# EAGLE design schematic (EAGLE 7.2.0)
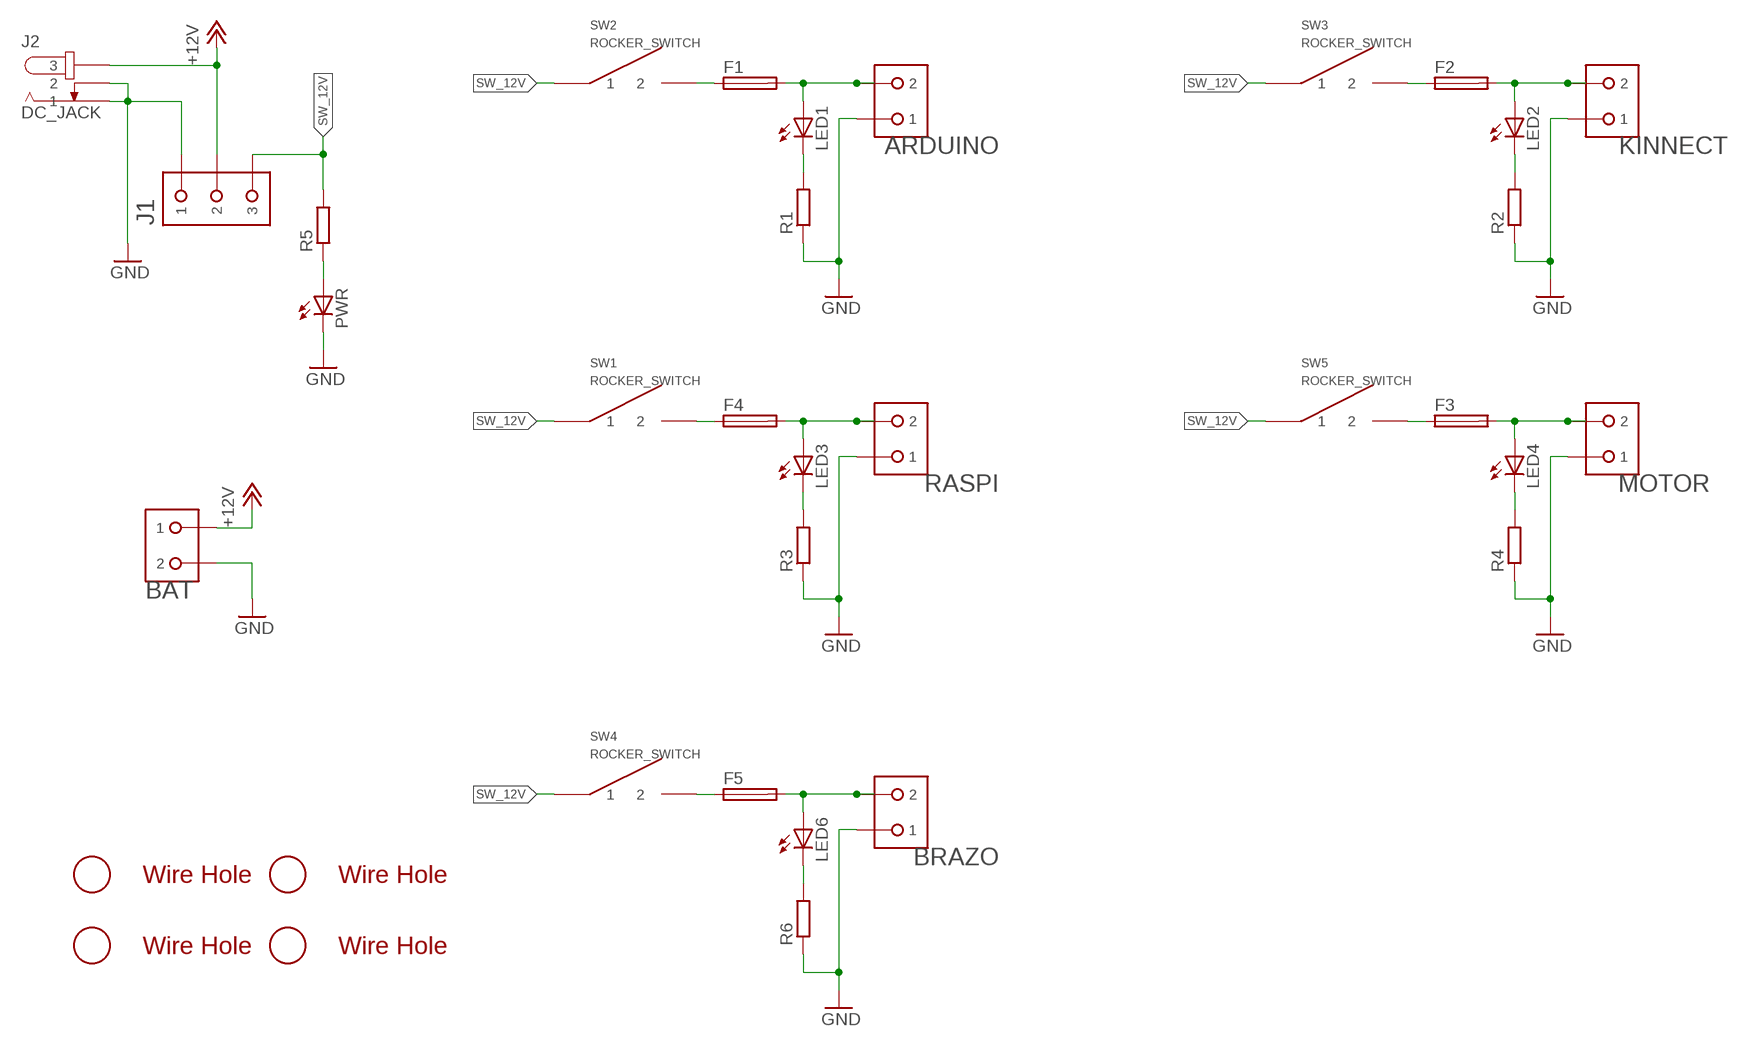
[diagram p0: schematic, sheet 1]

## Parts
ARDUINO  B2P-VH(LF)(SN)  [B2P]
BAT  B2P-VH(LF)(SN)  [B2P]
BRAZO  B2P-VH(LF)(SN)  [B2P]
F1  FUSETE5  [TE5]
F2  FUSETE5  [TE5]
F3  FUSETE5  [TE5]
F4  FUSETE5  [TE5]
F5  FUSETE5  [TE5]
J1  B3P-VH  [B3P-VH]
J2  DC_JACK  [DC_JACK]
KINNECT  B2P-VH(LF)(SN)  [B2P]
LED1  LEDCHIP-LED0805  [CHIP-LED0805]
LED2  LEDCHIP-LED0805  [CHIP-LED0805]
LED3  LEDCHIP-LED0805  [CHIP-LED0805]
LED4  LEDCHIP-LED0805  [CHIP-LED0805]
LED6  LEDCHIP-LED0805  [CHIP-LED0805]
MOTOR  B2P-VH(LF)(SN)  [B2P]
PWR  LED3MM  [LED3MM]
R1  R-EU_R0805  [R0805]
R2  R-EU_R0805  [R0805]
R3  R-EU_R0805  [R0805]
R4  R-EU_R0805  [R0805]
R5  R-EU_R0805  [R0805]
R6  R-EU_R0805  [R0805]
RASPI  B2P-VH(LF)(SN)  [B2P]
SW1  ROCKER_SWITCH  [ROCKER_SWITCH]
SW2  ROCKER_SWITCH  [ROCKER_SWITCH]
SW3  ROCKER_SWITCH  [ROCKER_SWITCH]
SW4  ROCKER_SWITCH  [ROCKER_SWITCH]
SW5  ROCKER_SWITCH  [ROCKER_SWITCH]
U$1  3MMHOLE  [3MMHOLE]
U$3  3MMHOLE  [3MMHOLE]
U$4  3MMHOLE  [3MMHOLE]
U$5  3MMHOLE  [3MMHOLE]

## Nets
+12V: BAT.1 J1.2 J2.2 J2.8 J2.9
GND: ARDUINO.1 BAT.2 BRAZO.1 J1.1 J2.1 J2.3 J2.4 J2.5 J2.6 J2.7 KINNECT.1 MOTOR.1 PWR.K(C) R1.1 R2.1 R3.1 R4.1 R6.1 RASPI.1
N$1: ARDUINO.2 F1.2 LED1.A
N$2: LED1.C R1.2
N$3: F2.2 KINNECT.2 LED2.A
N$5: F4.2 LED3.A RASPI.2
N$6: LED2.C R2.2
N$7: F3.2 LED4.A MOTOR.2
N$9: F1.1 SW2.P$12 SW2.P$13 SW2.P$14 SW2.P$15 SW2.P$16 SW2.P$17 SW2.P$18 SW2.P$19 SW2.P$20 SW2.P$21 SW2.P$22
N$10: F4.1 SW1.P$12 SW1.P$13 SW1.P$14 SW1.P$15 SW1.P$16 SW1.P$17 SW1.P$18 SW1.P$19 SW1.P$20 SW1.P$21 SW1.P$22
N$11: F3.1 SW5.P$12 SW5.P$13 SW5.P$14 SW5.P$15 SW5.P$16 SW5.P$17 SW5.P$18 SW5.P$19 SW5.P$20 SW5.P$21 SW5.P$22
N$12: F2.1 SW3.P$12 SW3.P$13 SW3.P$14 SW3.P$15 SW3.P$16 SW3.P$17 SW3.P$18 SW3.P$19 SW3.P$20 SW3.P$21 SW3.P$22
N$13: LED4.C R4.2
N$14: PWR.A R5.1
N$15: BRAZO.2 F5.2 LED6.A
N$17: F5.1 SW4.P$12 SW4.P$13 SW4.P$14 SW4.P$15 SW4.P$16 SW4.P$17 SW4.P$18 SW4.P$19 SW4.P$20 SW4.P$21 SW4.P$22
N$18: LED3.C R3.2
N$20: LED6.C R6.2
SW_12V: J1.3 R5.2 SW1.P$1 SW1.P$2 SW1.P$3 SW1.P$4 SW1.P$5 SW1.P$6 SW1.P$7 SW1.P$8 SW1.P$9 SW1.P$10 SW1.P$11 SW2.P$1 SW2.P$2 SW2.P$3 SW2.P$4 SW2.P$5 SW2.P$6 SW2.P$7 SW2.P$8 SW2.P$9 SW2.P$10 SW2.P$11 SW3.P$1 SW3.P$2 SW3.P$3 SW3.P$4 SW3.P$5 SW3.P$6 SW3.P$7 SW3.P$8 SW3.P$9 SW3.P$10 SW3.P$11 SW4.P$1 SW4.P$2 SW4.P$3 SW4.P$4 SW4.P$5 SW4.P$6 SW4.P$7 SW4.P$8 SW4.P$9 SW4.P$10 SW4.P$11 SW5.P$1 SW5.P$2 SW5.P$3 SW5.P$4 SW5.P$5 SW5.P$6 SW5.P$7 SW5.P$8 SW5.P$9 SW5.P$10 SW5.P$11

## Library data of the parts
ARDUINO BAT BRAZO KINNECT MOTOR RASPI = RoboJackets-Connectors:B2P?-VH(LF)(SN): Power Connector Brand: JST Sales America Inc. <https://www.jst.com/> Series: VH <http://www.digikey.com/product-search/en?FV=fff40016,fff802f3,ffec0e9d> Distributor: Digi-Key <http://www.digikey.com/product-detail/en/B2PS-VH%28LF%29%28SN%29/455-1648-ND/926555>; PINS: 2; PIN_PITCH: 3.96 mm
F1-F5 = fuse:FUSE: Fuse; OC_FARNELL: unknown; OC_NEWARK: unknown
J1 = 0user:B3P-VH
J2 = 0user:DC_JACK
LED1-LED4 LED6 = RepRapjr:LED: LED OSRAM: - CHIPLED LG R971, LG N971, LY N971, LG Q971, LY Q971, LO R971, LY R971 LH N974, LH R974 LS Q976, LO Q976, LY Q976 LO Q996 - Hyper CHIPLED LW Q18S LB Q993, LB Q99A, LB R99A - SideLED LS A670, LO A670, LY A670, LG A670, LP A670 LB A673, LV A673, LT A673, LW A673 LH A674 LY A675 LS A676, LA A676, LO A676, LY A676, LW A676 LS A679, LY A679, LG A679 - Hyper Micro SIDELED® LS Y876, LA Y876, LO Y876, LY Y876 LT Y87S - SmartLED LW L88C, LW L88S LB L89C, LB L89S, LG L890 LS L89K, LO L89K, LY L89K LS L896, LA L896, LO L896, LY L896 - TOPLED LS T670, LO T670, LY T670, LG T670, LP T670 LSG T670, LSP T670, LSY T670, LOP T670, LYG T670 LG T671, LOG T671, LSG T671 LB T673, LV T673, LT T673, LW T673 LH T674 LS T676, LA T676, LO T676, LY T676, LB T676, LH T676, LSB T676, LW T676 LB T67C, LV T67C, LT T67C, LS T67K, LO T67K, LY T67K, LW E67C LS E67B, LA E67B, LO E67B, LY E67B, LB E67C, LV E67C, LT E67C LW T67C LS T679, LY T679, LG T679 LS T770, LO T770, LY T770, LG T770, LP T770 LB T773, LV T773, LT T773, LW T773 LH T774 LS E675, LA E675, LY E675, LS T675 LS T776, LA T776, LO T776, LY T776, LB T776 LHGB T686 LT T68C, LB T68C - Hyper Mini TOPLED® LB M676 - Mini TOPLED Santana® LG M470 LS M47K, LO M47K, LY M47K Source: http://www.osram.convergy.de LUXEON: - LUMILED® LXK2-PW12-R00, LXK2-PW12-S00, LXK2-PW14-U00, LXK2-PW14-V00 LXK2-PM12-R00, LXK2-PM12-S00, LXK2-PM14-U00 LXK2-PE12-Q00, LXK2-PE12-R00, LXK2-PE12-S00, LXK2-PE14-T00, LXK2-PE14-U00 LXK2-PB12-K00, LXK2-PB12-L00, LXK2-PB12-M00, LXK2-PB14-N00, LXK2-PB14-P00, LXK2-PB14-Q00 LXK2-PR12-L00, LXK2-PR12-M00, LXK2-PR14-Q00, LXK2-PR14-R00 LXK2-PD12-Q00, LXK2-PD12-R00, LXK2-PD12-S00 LXK2-PH12-R00, LXK2-PH12-S00 LXK2-PL12-P00, LXK2-PL12-Q00, LXK2-PL12-R00 Source: www.luxeon.com KINGBRIGHT: KA-3528ASYC Source: www.kingbright.com
PWR = led:LED: LED OSRAM: - CHIPLED LG R971, LG N971, LY N971, LG Q971, LY Q971, LO R971, LY R971 LH N974, LH R974 LS Q976, LO Q976, LY Q976 LO Q996 - Hyper CHIPLED LW Q18S LB Q993, LB Q99A, LB R99A - SideLED LS A670, LO A670, LY A670, LG A670, LP A670 LB A673, LV A673, LT A673, LW A673 LH A674 LY A675 LS A676, LA A676, LO A676, LY A676, LW A676 LS A679, LY A679, LG A679 - Hyper Micro SIDELED® LS Y876, LA Y876, LO Y876, LY Y876 LT Y87S - SmartLED LW L88C, LW L88S LB L89C, LB L89S, LG L890 LS L89K, LO L89K, LY L89K LS L896, LA L896, LO L896, LY L896 - TOPLED LS T670, LO T670, LY T670, LG T670, LP T670 LSG T670, LSP T670, LSY T670, LOP T670, LYG T670 LG T671, LOG T671, LSG T671 LB T673, LV T673, LT T673, LW T673 LH T674 LS T676, LA T676, LO T676, LY T676, LB T676, LH T676, LSB T676, LW T676 LB T67C, LV T67C, LT T67C, LS T67K, LO T67K, LY T67K, LW E67C LS E67B, LA E67B, LO E67B, LY E67B, LB E67C, LV E67C, LT E67C LW T67C LS T679, LY T679, LG T679 LS T770, LO T770, LY T770, LG T770, LP T770 LB T773, LV T773, LT T773, LW T773 LH T774 LS E675, LA E675, LY E675, LS T675 LS T776, LA T776, LO T776, LY T776, LB T776 LHGB T686 LT T68C, LB T68C - Hyper Mini TOPLED® LB M676 - Mini TOPLED Santana® LG M470 LS M47K, LO M47K, LY M47K Source: http://www.osram.convergy.de LUXEON: - LUMILED® LXK2-PW12-R00, LXK2-PW12-S00, LXK2-PW14-U00, LXK2-PW14-V00 LXK2-PM12-R00, LXK2-PM12-S00, LXK2-PM14-U00 LXK2-PE12-Q00, LXK2-PE12-R00, LXK2-PE12-S00, LXK2-PE14-T00, LXK2-PE14-U00 LXK2-PB12-K00, LXK2-PB12-L00, LXK2-PB12-M00, LXK2-PB14-N00, LXK2-PB14-P00, LXK2-PB14-Q00 LXK2-PR12-L00, LXK2-PR12-M00, LXK2-PR14-Q00, LXK2-PR14-R00 LXK2-PD12-Q00, LXK2-PD12-R00, LXK2-PD12-S00 LXK2-PH12-R00, LXK2-PH12-S00 LXK2-PL12-P00, LXK2-PL12-Q00, LXK2-PL12-R00 Source: www.luxeon.com KINGBRIGHT: KA-3528ASYC Source: www.kingbright.com
R1-R6 = rcl:R-EU_: RESISTOR, European symbol
SW1-SW5 = 0user:ROCKER_SWITCH
U$1 U$3-U$5 = reprap:3MMHOLE

## Board
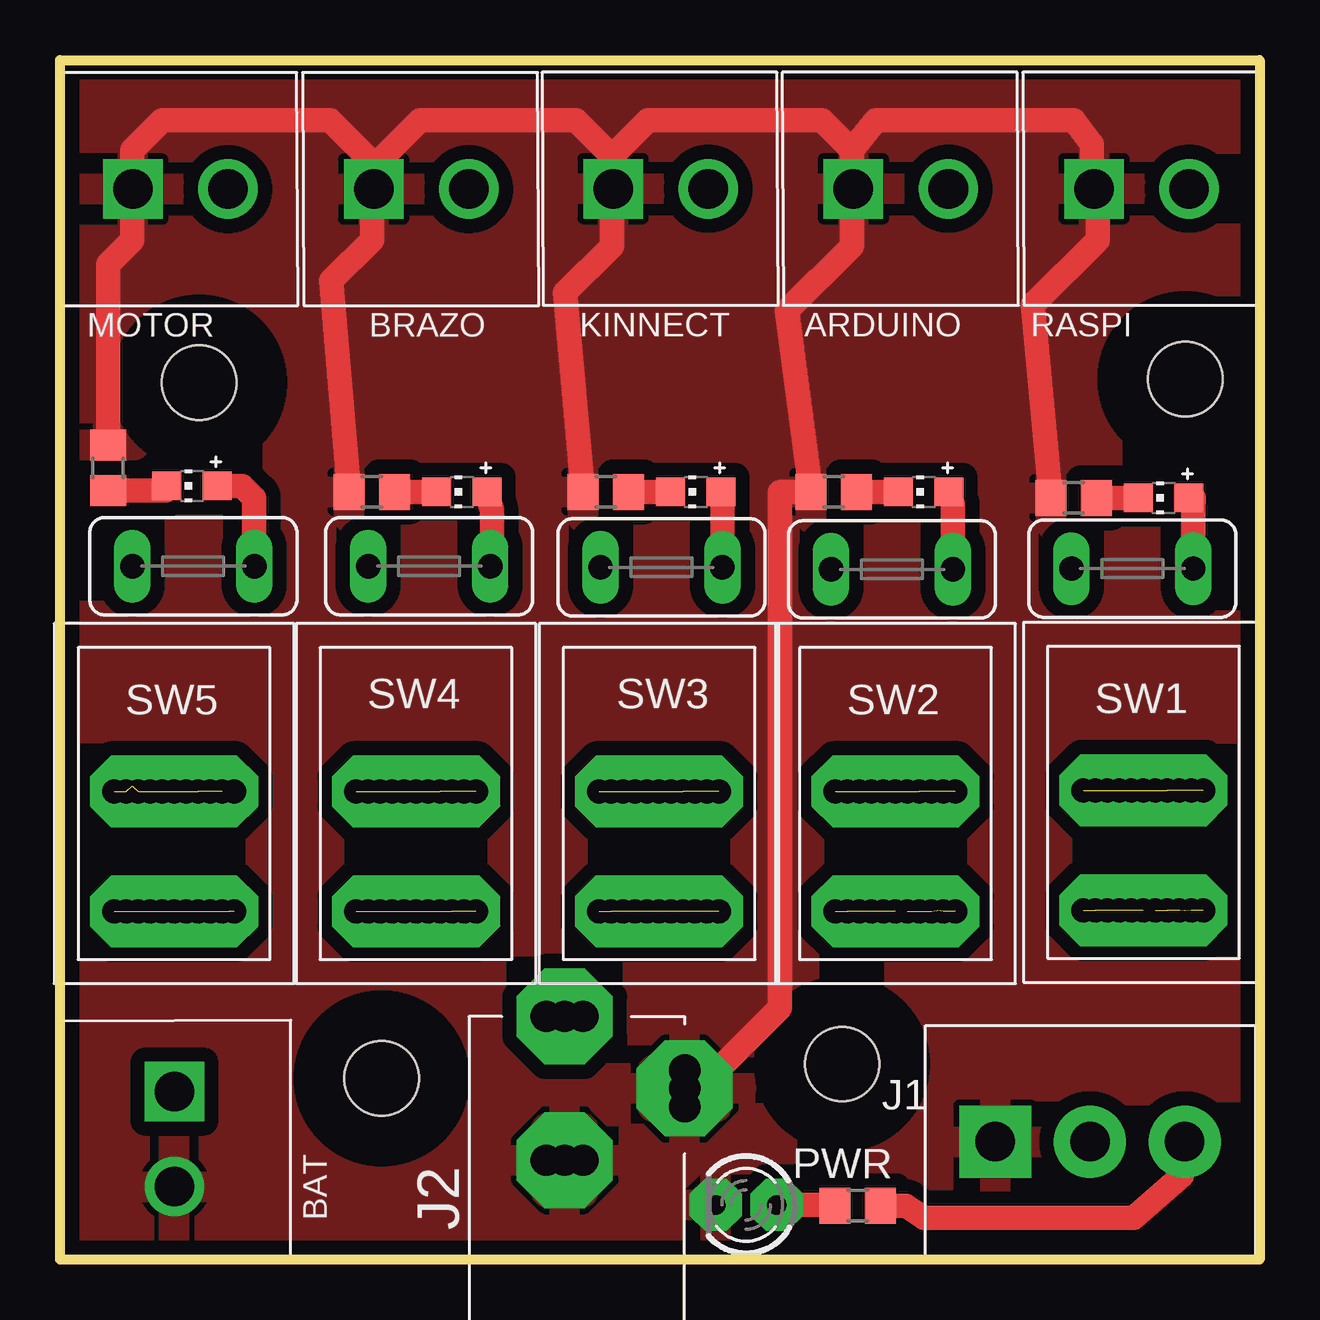
[diagram p1: board, top side]
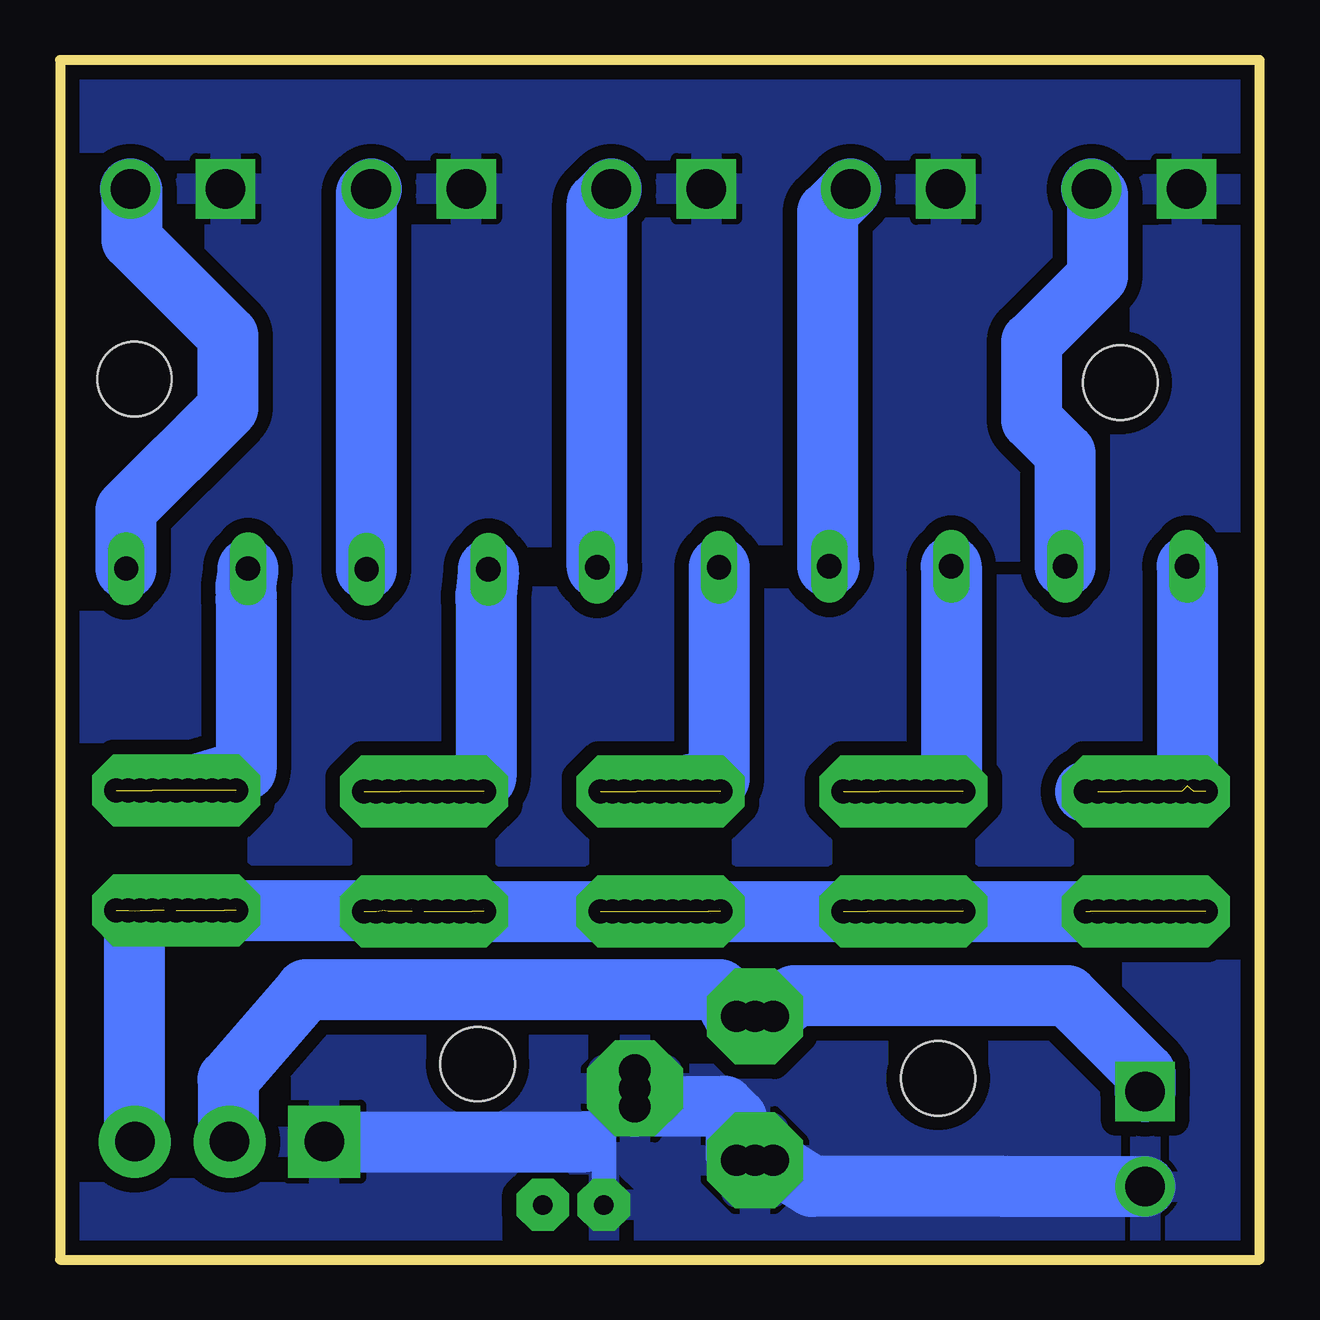
[diagram p2: board, bottom side, seen from below]

Size 50 x 50 mm. Coordinates in mm from the lower left corner, seen from the top.
Outline: 0,0 0,50 50,50 50,0 0,0
Copper layers (1*16): Top 0.035mm / dielectric 1.5mm / Bottom 0.035mm
Design rules "SeeedStudio_2layer_DRU_no_angle_20140221": minimum track width 6mil, minimum drill 12mil, track to track 6mil, track to pad 6mil, pad to pad 6mil, via to via 6mil, smd to smd 0mil, copper to edge 10mil, drill to drill 10mil, minimum pad ring 10mil, minimum via ring 6mil, stop-mask expansion 2mil, vias tented up to drill 100mil, thermal gap 10mil

### Footprints (pad centres in the part's own frame; a part is rotated, then mirrored left to right if it is on the bottom)
B2P = drill 1.65 square: 1 0.02,0 | drill 1.65: 2 3.98,0
TE5 = drill 1.016 long: 1 -2.54,0; 2 2.54,0
B3P-VH = drill 1.65 pad 3 square: 1 2.9,4.85 | drill 1.65 pad 3: 2 6.85,4.85; 3 10.8,4.85
DC_JACK = drill 1.3 pad 4 octagon: 1 -5.08,-2.083; 2 -0.076,-5.08; 3 -0.076,0.914 | drill 1.3: 4 -5.08,-2.845; 5 -5.08,-1.321; 6 -0.838,0.914; 7 0.686,0.914; 8 -0.838,-5.08; 9 0.686,-5.08
CHIP-LED0805 = smd 1.2 x 1.2: A 0,-1.05; C 0,1.05
LED3MM = drill 0.813 pad 2.184 octagon: A -1.27,0; K 1.27,0
R0805 = smd 1.3 x 1.5: 1 -0.95,0; 2 0.95,0
ROCKER_SWITCH = drill 1 pad 3 octagon: P$1 0,0; P$2 1,0; P$3 2,0; P$4 3,0; P$5 4,0; P$12 0,5; P$13 1,5; P$14 2,5; P$15 3,5; P$16 4,5 | drill 1: P$6 -0.5,0; P$7 0.5,0; P$8 1.5,0; P$9 2.5,0; P$10 3.5,0; P$11 4.5,0; P$17 -0.5,5; P$18 0.5,5; P$19 1.5,5; P$20 2.5,5; P$21 3.5,5; P$22 4.5,5
3MMHOLE = hole 3.1: 0,0

### Placement (x,y rotation side)
ARDUINO  33.05,44.63 0 top
BAT  4.77,7.02 270 top
BRAZO  13.06,44.62 0 top
F1  34.68,28.77 0 top
F2  25.07,28.85 0 top
F3  5.56,28.9 0 top
F4  44.7,28.8 0 top
F5  15.39,28.9 0 top
J1  36.08,0.06 0 top
J2  20.96,5.05 180 top
KINNECT  23.04,44.63 0 top
LED1  36,32 90 top
LED2  26.5,32 90 top
LED3  46,31.75 90 top
LED4  5.5,32.25 90 top
LED6  16.75,32 90 top
MOTOR  3.02,44.62 0 top
PWR  28.6,2.28 180 top
R1  32.25,32 0 top
R2  22.75,32 0 top
R3  42.25,31.75 0 top
R4  2,33 270 top
R5  33.25,2.25 0 top
R6  13,32 0 top
RASPI  43.08,44.63 0 top
SW1  43.16,14.56 0 top
SW2  32.83,14.51 0 top
SW3  22.97,14.51 0 top
SW4  12.84,14.51 0 top
SW5  2.75,14.51 0 top
U$1  5.8,36.55 0 top
U$3  46.9,36.7 0 top
U$4  13.4,7.55 0 top
U$5  32.6,8.15 0 top

### Tracks (layer width: path | path; a pad name or v marks a point on that pad's centre or on a via)
+12V
  Bottom 1.016: J2.9 J2.2 J2.8
  Bottom 2.54: J2.8 21.88,10.13 22.5,11.25 39.75,11.25 43,7.5 43,4.98 J1.2 | BAT.1 4.77,7.77 8,11 19.4,11 J2.9
GND
  Top 1.016: R4.1 2,41.5 3,42.5 3,44.58 | 3,44.58 MOTOR.1 | R6.1 11.3,40.8 13,42.5 13,44.54 | 13,44.54 BRAZO.1 | R2.1 21.05,40.3 23,42.25 23,44.57 | 23,44.57 KINNECT.1 | 33,44.56 33,42.25 30.3,39.55 R1.1 30,32 30,10.5 26.75,7.25 26.16,7.25 J2.1 | 33,44.56 ARDUINO.1 | R3.1 40.55,39.8 43.25,42.5 43.25,44.48 RASPI.1 43,44.73 43,46.5 42.25,47.5 34,47.5 33,46.25 | 33,44.56 33,46.25 | 23,44.57 23,46 | 23,46 24.5,47.5 31.75,47.5 33,46.25 | 13,44.54 13,45.5 13.12,45.62 | 13.12,45.62 15,47.5 21.5,47.5 23,46 | 3,44.58 3,46.25 4.25,47.5 11.25,47.5 13.12,45.62
  Bottom 0.406: 28.08,4.91 26.8,6.19
  Bottom 1.016: PWR.K 27.33,6.63 26.8,6.19 26.25,6.75
  Bottom 2.54: J2.5 22.3,6.39 21.8,5.88 J2.6 21.41,3.75 19.75,3.75 18.65,3.05 10.65,3.05 10.46,3.04 BAT.2 | J1.1 28.08,4.91
  pour Bottom (isolate 0.6): 0,0 0,50 50,50 50,0
  pour Top (isolate 0.6): 0,0 0,50 50,50 50,0
N$1
  Top 1.016: LED1.A 36.97,32 37.22,31.5 F1.2
  Bottom 2.54: F1.2 37.22,44.44 ARDUINO.2
N$2
  Top 1.016: R1.2 LED1.C
N$3
  Top 1.016: LED2.A 27.61,32 F2.2
  Bottom 2.54: F2.2 27.61,44.04 KINNECT.2
N$5
  Top 1.016: LED3.A 47.25,31.75 47.24,31.26 F4.2
  Bottom 2.54: F4.2 47.24,31.26 43,35.5 43,38.5 47,42.5 47,44.57 RASPI.2
N$6
  Top 1.016: LED2.C R2.2
N$7
  Top 1.016: LED4.A 7.6,32.25 8.1,31.75 F3.2
  Bottom 2.54: F3.2 8.1,33.6 9.5,35 9.5,38.25 6.75,41 6.75,44.37 MOTOR.2
N$9  (10 unrouted)
  Bottom 2.54: F1.1 32.24,27.71 32.25,27.5 32.25,20.09 SW2.P$12
N$10  (10 unrouted)
  Bottom 2.54: F4.1 42.26,28.09 42.25,27.5 42.25,20.42 SW1.P$14
N$11  (10 unrouted)
  Bottom 2.54: F3.1 3.02,19.74 SW5.P$22
N$12  (10 unrouted)
  Bottom 2.54: F2.1 22.53,20.05 SW3.P$14
N$13
  Top 1.016: R4.2 4.4,32.05 LED4.C
N$14
  Top 1.016: PWR.A 32.3,2.28 R5.1
N$15
  Top 1.016: LED6.A 17.75,32 18,31.25 18,28.97 F5.2
  Bottom 2.54: F5.2 18,28.9 18,43.66 BRAZO.2
N$17  (10 unrouted)
  Bottom 2.54: F5.1 SW4.P$12
N$18
  Top 1.016: LED3.C R3.2
N$20
  Top 1.016: R6.2 LED6.C
SW_12V  (51 unrouted)
  Top 1.016: R5.2 35.25,2.25 36,1.75 44.75,1.75 46.75,3.5 46.75,4.78 J1.3
  Bottom 2.54: J1.3 46.88,14.54 SW1.P$1 | SW1.P$9 36.58,14.56 SW2.P$1 | SW2.P$9 SW3.P$1 | SW3.P$9 SW4.P$10 | SW4.P$9 7.05,14.51